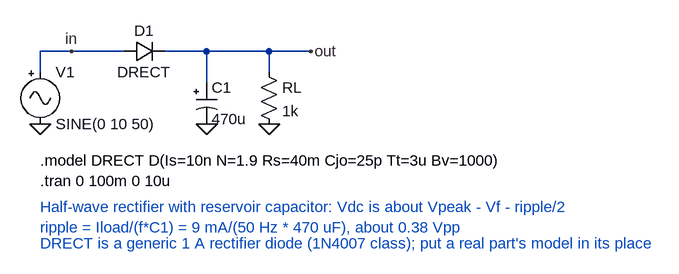
[diagram p0: schematic halfwave_rectifier.asc]
halfwave_rectifier.asc, the LTspice schematic file:
Version 4
SHEET 1 880 680
WIRE 32 112 32 144
WIRE 160 112 32 112
WIRE 288 112 224 112
WIRE 384 112 288 112
WIRE 448 112 384 112
WIRE 288 160 288 112
WIRE 384 144 384 112
FLAG 32 224 0
FLAG 288 224 0
FLAG 384 224 0
FLAG 80 112 in
FLAG 448 112 out
SYMBOL Misc\signal 32 128 R0
SYMATTR InstName V1
SYMATTR Value SINE(0 10 50)
SYMBOL diode 160 128 R270
WINDOW 0 32 32 VTop 2
WINDOW 3 0 32 VBottom 2
SYMATTR InstName D1
SYMATTR Value DRECT
SYMBOL polcap 272 160 R0
SYMATTR InstName C1
SYMATTR Value 470u
SYMBOL res 368 128 R0
SYMATTR InstName RL
SYMATTR Value 1k
TEXT 32 280 Left 2 !.model DRECT D(Is=10n N=1.9 Rs=40m Cjo=25p Tt=3u Bv=1000)
TEXT 32 312 Left 2 !.tran 0 100m 0 10u
TEXT 32 352 Left 2 ;Half-wave rectifier with reservoir capacitor: Vdc is about Vpeak - Vf - ripple/2\nripple = Iload/(f*C1) = 9 mA/(50 Hz * 470 uF), about 0.38 Vpp
TEXT 32 408 Left 2 ;DRECT is a generic 1 A rectifier diode (1N4007 class); put a real part's model in its place

The netlist it stands for:
* halfwave_rectifier.asc
V1 in 0 SINE(0 10 50)
D1 in out DRECT
C1 out 0 470u
RL out 0 1k
.model D D
.lib standard.dio
.model DRECT D(Is=10n N=1.9 Rs=40m Cjo=25p Tt=3u Bv=1000)
.tran 0 100m 0 10u
* Half-wave rectifier with reservoir capacitor: Vdc is about Vpeak - Vf - ripple/2
* ripple = Iload/(f*C1) = 9 mA/(50 Hz * 470 uF), about 0.38 Vpp
* DRECT is a generic 1 A rectifier diode (1N4007 class); put a real part's model in its place
.backanno
.end